# EAGLE schematic schemFinal (EAGLE 9.6.2)
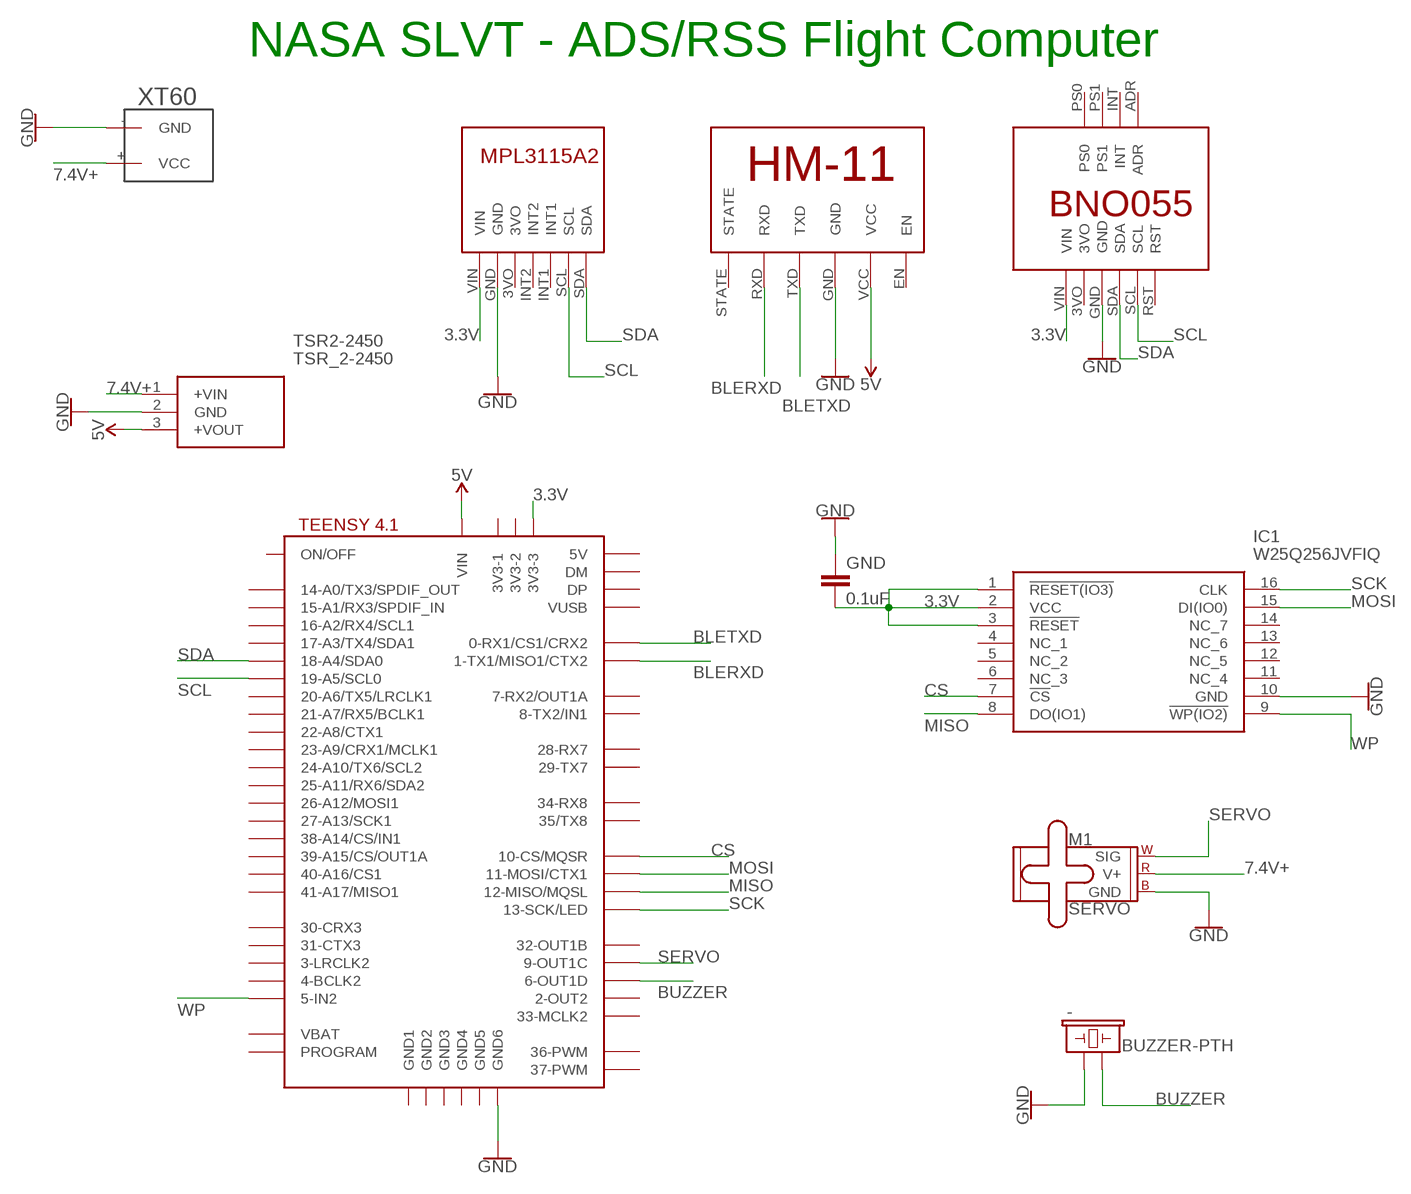
[diagram p0: schematic, sheet 1]

## Parts
-  BUZZER-PTH  [BUZZER-12MM]
GND  0.1uF  22PF-PTH-2.54MM-200V-5%  [CAP-PTH-2.54]
IC1  W25Q256JVFIQ  [SOIC127P1032X264-16N]
M1  SERVO  [1X03]
TSR2-2450  TSR_2-2450  [TSR-2]
U$1  BNO055  [BNO055]
U$2  MPL3115A2  [MPL3115A2]
U$3  TEENSY41-E  [TENNSY41-E]
U$4  HM-11  [HM-11]
U$5  XT60  [XT60]

## Nets
3.3V: GND.2 IC1.1(!RESET(IO3)) IC1.2(VCC) IC1.3(!RESET) U$1.VIN U$2.VIN U$3.3V3-3
5V: TSR2-2450.3(+VOUT) U$3.VIN U$4.VCC
7.4V+: M1.2(V+) TSR2-2450.1(+VIN) U$5.+(VCC)
BLERXD: U$3.1-TX1/MISO1/CTX2 U$4.RXD
BLETXD: U$3.0-RX1/CS1/CRX2 U$4.TXD
BUZZER: -.- U$3.6-OUT1D
CS: IC1.7(!CS) U$3.10-CS\MQSR(10-CS/MQSR)
GND: -.+ GND.1 IC1.10(GND) M1.3(GND) TSR2-2450.2(GND) U$1.GND U$2.GND U$3.GND6 U$4.GND U$5.-(GND)
MISO: IC1.8(DO(IO1)) U$3.12-MISO/MQSL
MOSI: IC1.15(DI(IO0)) U$3.11-MOSI/CTX1
SCK: IC1.16(CLK) U$3.13-SCK/LED
SCL: U$1.SCL U$2.SCL U$3.19-A5/SCL0
SDA: U$1.SDA U$2.SDA U$3.18-A4/SDA0
SERVO: M1.1(SIG) U$3.9-OUT1C
WP: IC1.9(!WP(IO2)) U$3.5-IN2
Unconnected: IC1.4(NC_1) IC1.5(NC_2) IC1.6(NC_3) IC1.11(NC_4) IC1.12(NC_5) IC1.13(NC_6) IC1.14(NC_7) U$1.3VO U$1.ADR U$1.INT U$1.PS0 U$1.PS1 U$1.RST U$2.3VO U$2.INT1 U$2.INT2 U$3.2-OUT2 U$3.3-LRCLK2 U$3.3V3-1 U$3.3V3-2 U$3.4-BCLK2 U$3.7-RX2/OUT1A U$3.8-TX2/IN1 U$3.14-A0/TX3/SPDIF_OUT U$3.15-A1/RX3/SPDIF_IN U$3.16-A2/RX4/SCL1 U$3.17-A3/TX4/SDA1 U$3.20-A6/TX5/LRCLK1 U$3.21-A7/RX5/BCLK1 U$3.22-A8/CTX1 U$3.23-A9/CRX1/MCLK1 U$3.24-A10/TX6/SCL2 U$3.25-A11/RX6/SDA2 U$3.26-A12/MOSI1 U$3.27-A13/SCK1 U$3.28-RX7 U$3.29-TX7 U$3.30-CRX3 U$3.31-CTX3 U$3.32-OUT1B U$3.33-MCLK2 U$3.34-RX8 U$3.35-TX8(35/TX8) U$3.36-PWM U$3.37-PWM U$3.38-A14/CS/IN1 U$3.39-A15/CS/OUT1A U$3.40-A16/CS1 U$3.41-A17/MISO1 U$3.+5V(5V) U$3.DM U$3.DP U$3.GND1 U$3.GND2 U$3.GND3 U$3.GND4 U$3.GND5 U$3.ON/OFF U$3.PROGRAM U$3.VBAT U$3.VUSB U$4.EN U$4.STATE

## Notes on the sheet
- NASA SLVT - ADS/RSS Flight Computer

## Library data of the parts
- = SparkFun-Electromechanical:BUZZER: Buzzer Small round buzzers that operate around the audible 2kHz range. You can use these as speakers to create simple music or user interfaces. Variant Overview: PTH - Mini Speaker - PC Mount 12mm 2.048kHz <https://www.sparkfun.com/products/7950> PTH_KIT - Mini Speaker - PC Mount 12mm 2.048kHz <https://www.sparkfun.com/products/7950> KIT simplifies soldering by adding stop mask to one side of the pads. PTH_NO_SILK - Mini Speaker - PC Mount 12mm 2.048kHz <https://www.sparkfun.com/products/7950> No silkscreen indicator of buzzer outline. PTH_KIT_NO_SILK - Mini Speaker - PC Mount 12mm 2.048kHz <https://www.sparkfun.com/products/7950> KIT package w/o silkscreen SMD - Buzzer Audio Magnetic (CCV-084B16) SMD buzzer used on, e.g. the LilyPad Buzzer <https://www.sparkfun.com/products/8463> and RFID USB Reader <https://www.sparkfun.com/products/9963>. SMD_KIT - Buzzer Audio Magnetic (CCV-084B16) SMD Buzzer with elongated pins to make soldering easier. Used on the SparkFun Simon Says - Surface Mount Soldering Kit <https://www.sparkfun.com/products/10935>. SMD-SQUARE - Buzzer Audio Magnetic (COMP-15701) SMT square buzzer with one chamfered corner.; PROD_ID: COMP-08253; SF_SKU: COM-07950
GND = SparkFun-Capacitors:22PF: 22pF ceramic capacitors A capacitor is a passive two-terminal electrical component used to store electrical energy temporarily in an electric field.; PROD_ID: CAP-09128; VALUE: 22pF
IC1 = W25Q256JVFIQ:W25Q256JVFIQ: 256M-bit Serial Flash Memory with uniform 4KB sectors and Dual/Quad SPI Source: Datasheet <https://www.winbond.com/hq/search-resource-file.jsp?partNo=W25Q256JVFIQ&type=datasheet>; ARROW_PART_NUMBER: W25Q256JVFIQ; ARROW_PRICE-STOCK: https://www.arrow.com/en/products/w25q256jvfiq/winbond-electronics?region=nac; DESCRIPTION: 256M-bit Serial Flash Memory with uniform 4KB sectors and Dual/Quad SPI; HEIGHT: 2.64mm; MANUFACTURER_NAME: Winbond; MANUFACTURER_PART_NUMBER: W25Q256JVFIQ; MOUSER_PART_NUMBER: 454-W25Q256JVFIQ; MOUSER_PRICE-STOCK: https://www.mouser.co.uk/ProductDetail/Winbond/W25Q256JVFIQ?qs=qSfuJ%252Bfl%2Fd66Mf%2FmOCw4Wg%3D%3D
M1 = SparkFun-Electromechanical:SERVO: Servo Motor 3-pin connector for a standard servo motor (voltage supply, ground, and control signal.) SparkFun Products Servo - Generic (Sub-Micro Size) <https://www.sparkfun.com/products/9065> (ROB-09065) Servo - Generic High Torque Continuous Rotation (Standard Size) <https://www.sparkfun.com/products/9347> (ROB-09347) Servo - Generic High Torque (Standard Size) <https://www.sparkfun.com/products/11965> (ROB-11965)
TSR2-2450 = TSR_2-2450:TSR_2-2450: 2 Amp POL switching regulator, 3.0 to -36 VDC input, pos.-pos. circuit, LM78 compatible, SIP-3 Source: Datasheet <https://tracopower.com/tsr2-datasheet/>; DESCRIPTION: 2 Amp POL switching regulator, 3.0 to -36 VDC input, pos.-pos. circuit, LM78 compatible, SIP-3; HEIGHT: mm; MANUFACTURER_NAME: Traco Power; MANUFACTURER_PART_NUMBER: TSR 2-2450; MOUSER_PART_NUMBER: 495-TSR2-2450; MOUSER_PRICE-STOCK: https://www.mouser.co.uk/ProductDetail/TRACO-Power/TSR-2-2450?qs=NtE2QagKf6RzknAolzm%2FTQ%3D%3D
U$1 = BNO055:BNO055
U$2 = MPL3115A2:MPL3115A2
U$3 = teensy:TEENSY41-E
U$4 = HM-11:HM-11
U$5 = XT60:XT60: XT60